# Altium schematic sheet 03_electrode_interface.SchDoc
size A3
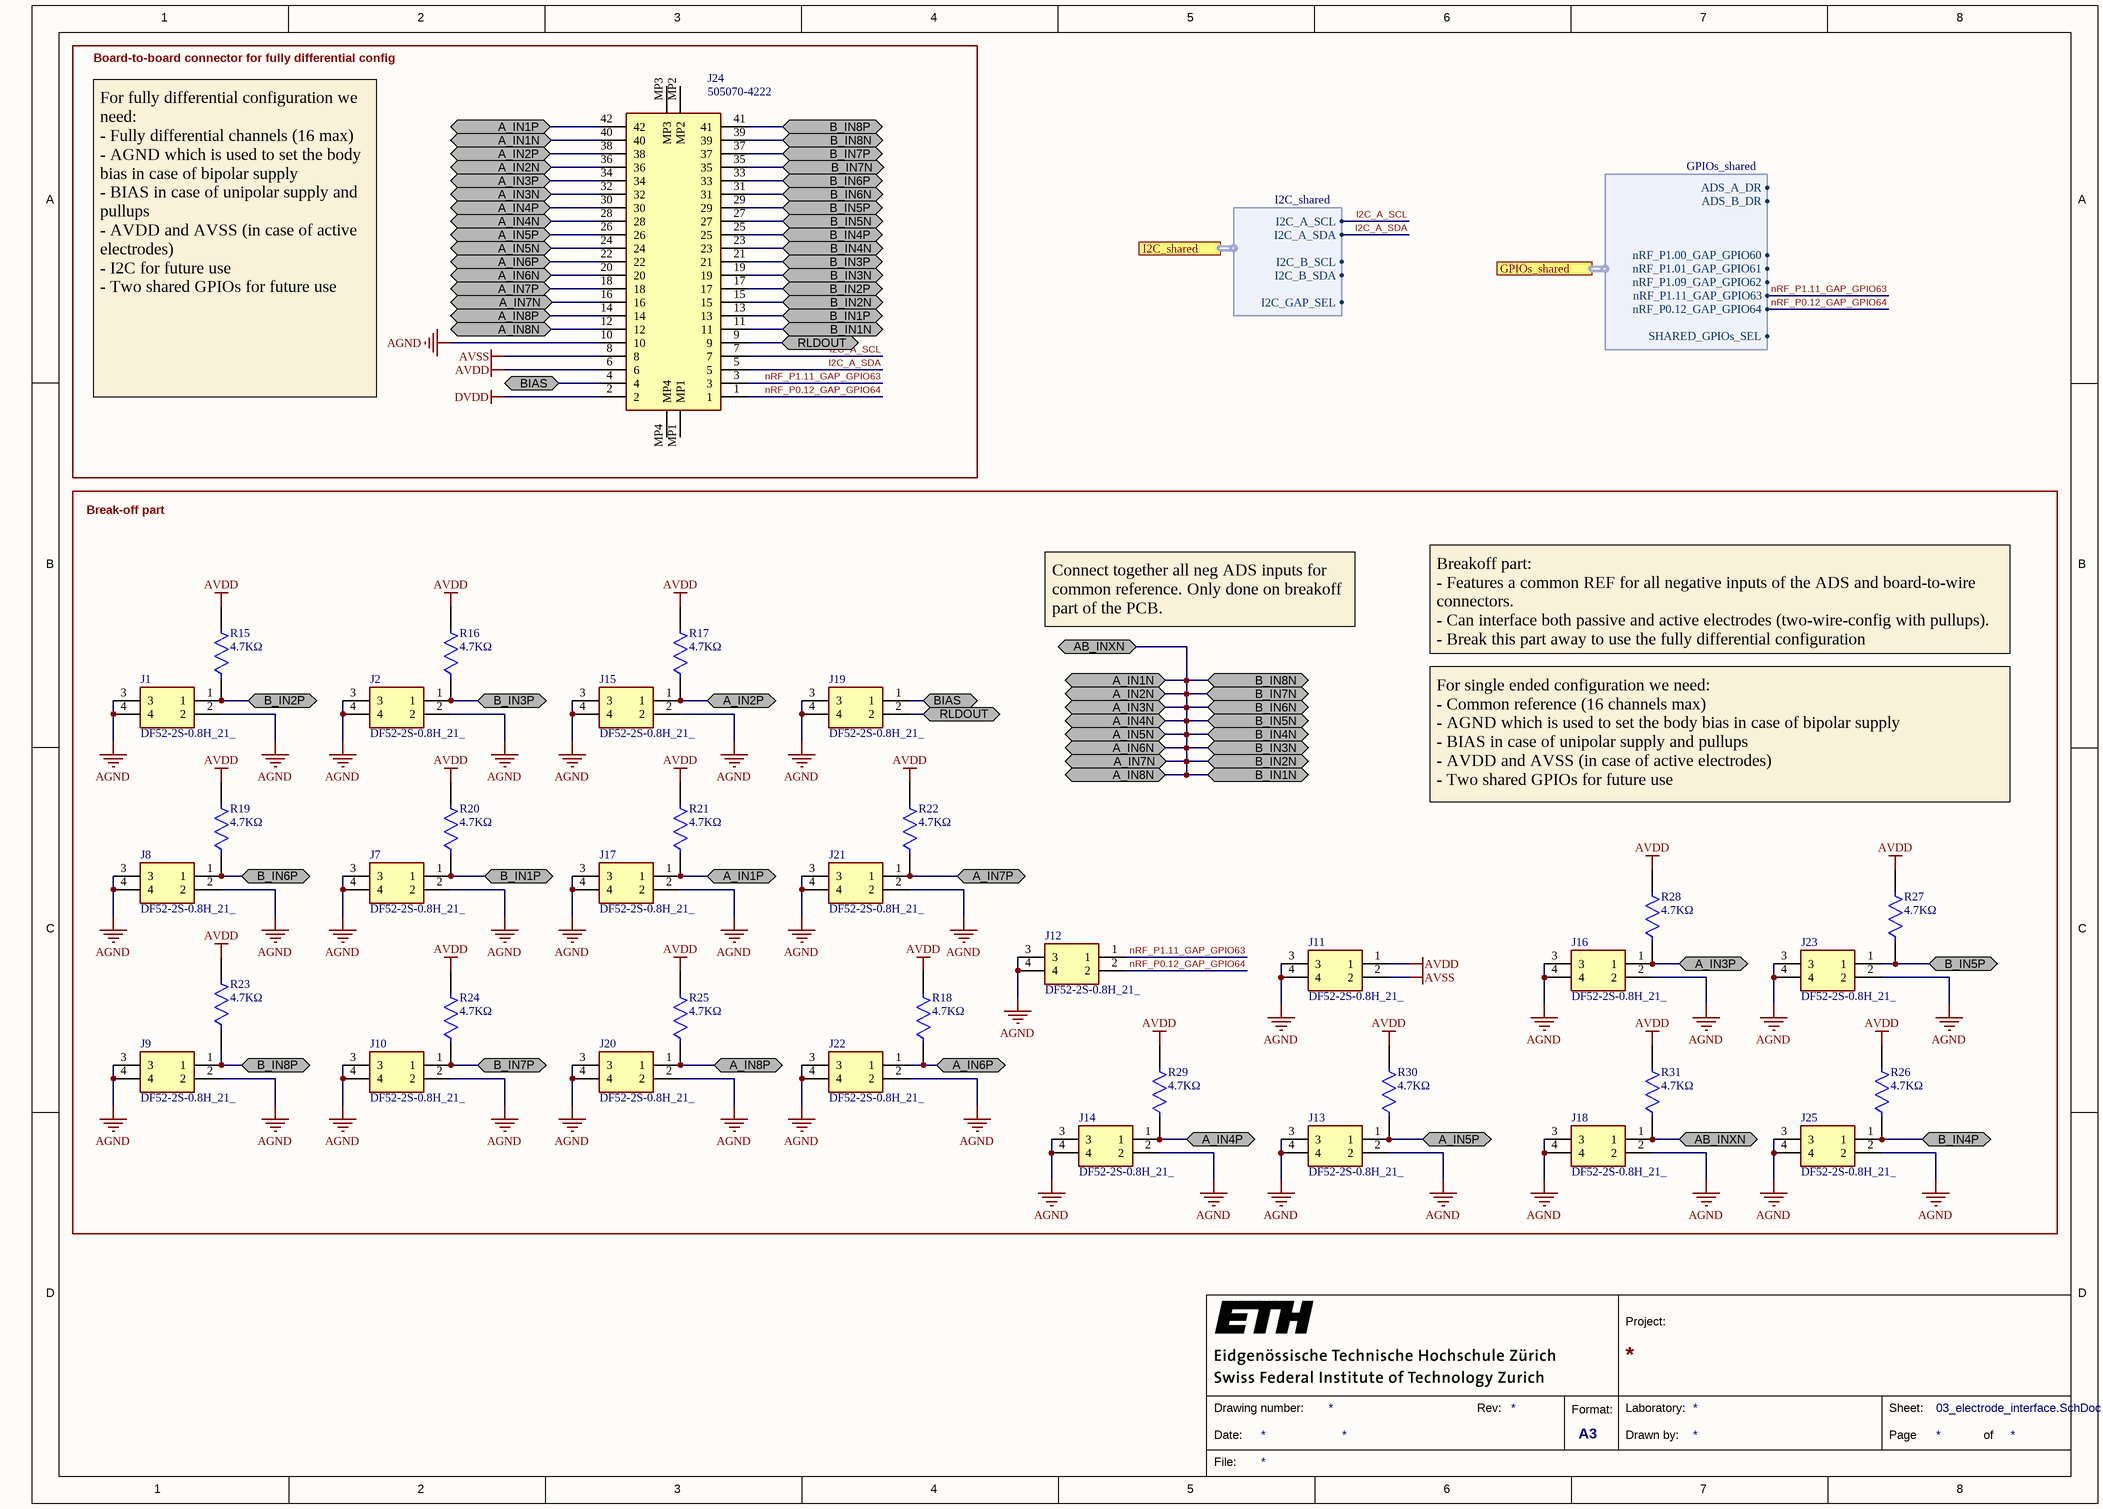
[diagram p0: 03_electrode_interface.SchDoc]

## Parts
J1  DF52-2S-0.8H_21_  [DF522S08H21]
J2  DF52-2S-0.8H_21_  [DF522S08H21]
J7  DF52-2S-0.8H_21_  [DF522S08H21]
J8  DF52-2S-0.8H_21_  [DF522S08H21]
J9  DF52-2S-0.8H_21_  [DF522S08H21]
J10  DF52-2S-0.8H_21_  [DF522S08H21]
J11  DF52-2S-0.8H_21_  [DF522S08H21]
J12  DF52-2S-0.8H_21_  [DF522S08H21]
J13  DF52-2S-0.8H_21_  [DF522S08H21]
J14  DF52-2S-0.8H_21_  [DF522S08H21]
J15  DF52-2S-0.8H_21_  [DF522S08H21]
J16  DF52-2S-0.8H_21_  [DF522S08H21]
J17  DF52-2S-0.8H_21_  [DF522S08H21]
J18  DF52-2S-0.8H_21_  [DF522S08H21]
J19  DF52-2S-0.8H_21_  [DF522S08H21]
J20  DF52-2S-0.8H_21_  [DF522S08H21]
J21  DF52-2S-0.8H_21_  [DF522S08H21]
J22  DF52-2S-0.8H_21_  [DF522S08H21]
J23  DF52-2S-0.8H_21_  [DF522S08H21]
J24  505070-4222  [5050704222]
J25  DF52-2S-0.8H_21_  [DF522S08H21]
R15  value 4.7KΩ  [FP-RT0402-MFG]  (hidden comment: RT0402FRE074K7L)
R16  value 4.7KΩ  [FP-RT0402-MFG]  (hidden comment: RT0402FRE074K7L)
R17  value 4.7KΩ  [FP-RT0402-MFG]  (hidden comment: RT0402FRE074K7L)
R18  value 4.7KΩ  [FP-RT0402-MFG]  (hidden comment: RT0402FRE074K7L)
R19  value 4.7KΩ  [FP-RT0402-MFG]  (hidden comment: RT0402FRE074K7L)
R20  value 4.7KΩ  [FP-RT0402-MFG]  (hidden comment: RT0402FRE074K7L)
R21  value 4.7KΩ  [FP-RT0402-MFG]  (hidden comment: RT0402FRE074K7L)
R22  value 4.7KΩ  [FP-RT0402-MFG]  (hidden comment: RT0402FRE074K7L)
R23  value 4.7KΩ  [FP-RT0402-MFG]  (hidden comment: RT0402FRE074K7L)
R24  value 4.7KΩ  [FP-RT0402-MFG]  (hidden comment: RT0402FRE074K7L)
R25  value 4.7KΩ  [FP-RT0402-MFG]  (hidden comment: RT0402FRE074K7L)
R26  value 4.7KΩ  [FP-RT0402-MFG]  (hidden comment: RT0402FRE074K7L)
R27  value 4.7KΩ  [FP-RT0402-MFG]  (hidden comment: RT0402FRE074K7L)
R28  value 4.7KΩ  [FP-RT0402-MFG]  (hidden comment: RT0402FRE074K7L)
R29  value 4.7KΩ  [FP-RT0402-MFG]  (hidden comment: RT0402FRE074K7L)
R30  value 4.7KΩ  [FP-RT0402-MFG]  (hidden comment: RT0402FRE074K7L)
R31  value 4.7KΩ  [FP-RT0402-MFG]  (hidden comment: RT0402FRE074K7L)

## Blocks framed on the sheet
Board-to-board connector for fully differential config: J24
Break-off part: J1 J2 J7-J23 J25 R15-R31

## Ports
A_IN1N (bidir), A_IN1P (bidir), A_IN2N (bidir), A_IN2P (bidir), A_IN3N (bidir), A_IN3P (bidir), A_IN4N (bidir), A_IN4P (bidir), A_IN5N (bidir), A_IN5P (bidir), A_IN6N (bidir), A_IN6P (bidir), A_IN7N (bidir), A_IN7P (bidir), A_IN8N (bidir), A_IN8P (bidir), AB_INXN (bidir), B_IN1N (bidir), B_IN1P (bidir), B_IN2N (bidir), B_IN2P (bidir), B_IN3N (bidir), B_IN3P (bidir), B_IN4N (bidir), B_IN4P (bidir), B_IN5N (bidir), B_IN5P (bidir), B_IN6N (bidir), B_IN6P (bidir), B_IN7N (bidir), B_IN7P (bidir), B_IN8N (bidir), B_IN8P (bidir), BIAS (bidir), GPIOs_shared (harness GPIOs_shared), I2C_shared (harness I2C_shared), RLDOUT (bidir)

## Harnesses
GPIOs_shared: ADS_A_DR, ADS_B_DR, nRF_P1.00_GAP_GPIO60, nRF_P1.09_GAP_GPIO62, nRF_P1.11_GAP_GPIO63, nRF_P0.12_GAP_GPIO64, SHARED_GPIOs_SEL, nRF_P1.01_GAP_GPIO61
I2C_shared: I2C_A_SCL, I2C_A_SDA, I2C_B_SCL, I2C_B_SDA, I2C_GAP_SEL

## Nets
AGND: J1.2 J1.3 J1.4 J2.2 J2.3 J2.4 J7.2 J7.3 J7.4 J8.2 J8.3 J8.4 J9.2 J9.3 J9.4 J10.2 J10.3 J10.4 J11.3 J11.4 J12.3 J12.4 J13.2 J13.3 J13.4 J14.2 J14.3 J14.4 J15.2 J15.3 J15.4 J16.2 J16.3 J16.4 J17.2 J17.3 J17.4 J18.2 J18.3 J18.4 J19.3 J19.4 J20.2 J20.3 J20.4 J21.2 J21.3 J21.4 J22.2 J22.3 J22.4 J23.2 J23.3 J23.4 J24.10 J25.2 J25.3 J25.4
AVDD: J11.1 J24.6 R15.2 R16.2 R17.2 R18.2 R19.2 R20.2 R21.2 R22.2 R23.2 R24.2 R25.2 R26.2 R27.2 R28.2 R29.2 R30.2 R31.2
AVSS: J11.2 J24.8
DVDD: J24.2
A_IN1N: J18.1 J24.11 J24.12 J24.15 J24.16 J24.19 J24.20 J24.23 J24.24 J24.27 J24.28 J24.31 J24.32 J24.35 J24.36 J24.39 J24.40 R31.1 ; port A_IN1N, port A_IN2N, port A_IN3N, port A_IN4N, port A_IN5N, port A_IN6N, port A_IN7N, port A_IN8N, port B_IN1N, port B_IN2N, port B_IN3N, port B_IN4N, port B_IN5N, port B_IN6N, port B_IN7N, port B_IN8N, port AB_INXN
A_IN1P: J17.1 J24.42 R21.1 ; port A_IN1P
A_IN2P: J15.1 J24.38 R17.1 ; port A_IN2P
A_IN3P: J16.1 J24.34 R28.1 ; port A_IN3P
A_IN4P: J14.1 J24.30 R29.1 ; port A_IN4P
A_IN5P: J13.1 J24.26 R30.1 ; port A_IN5P
A_IN6P: J22.1 J24.22 R18.1 ; port A_IN6P
A_IN7P: J21.1 J24.18 R22.1 ; port A_IN7P
A_IN8P: J20.1 J24.14 R25.1 ; port A_IN8P
B_IN1P: J7.1 J24.13 R20.1 ; port B_IN1P
B_IN2P: J1.1 J24.17 R15.1 ; port B_IN2P
B_IN3P: J2.1 J24.21 R16.1 ; port B_IN3P
B_IN4P: J24.25 J25.1 R26.1 ; port B_IN4P
B_IN5P: J23.1 J24.29 R27.1 ; port B_IN5P
B_IN6P: J8.1 J24.33 R19.1 ; port B_IN6P
B_IN7P: J10.1 J24.37 R24.1 ; port B_IN7P
B_IN8P: J9.1 J24.41 R23.1 ; port B_IN8P
BIAS: J19.1 J24.4 ; port BIAS
I2C_A_SCL: J24.7 ; port I2C_shared.I2C_A_SCL
I2C_A_SDA: J24.5 ; port I2C_shared.I2C_A_SDA
nRF_P0.12_GAP_GPIO64: J12.2 J24.1 ; port GPIOs_shared.nRF_P0.12_GAP_GPIO64
nRF_P1.11_GAP_GPIO63: J12.1 J24.3 ; port GPIOs_shared.nRF_P1.11_GAP_GPIO63
RLDOUT: J19.2 J24.9 ; port RLDOUT

Not connected (* = marked no-connect by the designer): J24 MP1 MP2 MP3 MP4

## Notes on the sheet
- For fully differential configuration we need:
  - Fully differential channels (16 max)
  - AGND which is used to set the body bias in case of bipolar supply
  - BIAS in case of unipolar supply and pullups
  - AVDD and AVSS (in case of active electrodes)
  - I2C for future use
  - Two shared GPIOs for future use
- Connect together all neg ADS inputs for common reference. Only done on breakoff part of the PCB.
- Breakoff part:
  - Features a common REF for all negative inputs of the ADS and board-to-wire connectors.
  - Can interface both passive and active electrodes (two-wire-config with pullups).
  - Break this part away to use the fully differential configuration
- For single ended configuration we need:
  - Common reference (16 channels max)
  - AGND which is used to set the body bias in case of bipolar supply
  - BIAS in case of unipolar supply and pullups
  - AVDD and AVSS (in case of active electrodes)
  - Two shared GPIOs for future use
- 1
- 2
- 3
- 4
- 5
- 6
- 7
- 8
- A
- B
- C
- D
- Project:
- Date:
- Drawing number:
- Rev:
- Format:
- A3
- Drawn by:
- Laboratory:
- Page
- Sheet:
- of
- File:

## Library data of the parts
J1 J2 J7-J23 J25 = DF52-2S-0.8H_21_: Connector; Manufacturer_Name: Hirose; Manufacturer_Part_Number: DF52-2S-0.8H(21); Datasheet Link: https://datasheet.datasheetarchive.com/originals/distributors/DKDS-30/591726.pdf; Height: 1mm; Mouser Part Number: 798-DF52-2S-0.8H21; Mouser Price/Stock: https://www.mouser.co.uk/ProductDetail/Hirose-Connector/DF52-2S-0.8H21?qs=%2FKR40Cd6GUpAHUMGMtWbig%3D%3D
J24 = 505070-4222: Connector; Manufacturer_Name: Molex; Manufacturer_Part_Number: 505070-4022; Datasheet Link: https://componentsearchengine.com/Datasheets/1/505070-4022.pdf; Height: 0.53mm; Mouser Part Number: 538-505070-4022; Mouser Price/Stock: https://www.mouser.co.uk/ProductDetail/Molex/505070-4022?qs=byeeYqUIh0Nt60HVGOVJPw%3D%3D
R15-R31 = CMP-2002-02901-2: RES 4.70K OHM 1/16W 1% SMD 0402; Manufacturer: Yageo; Voltage Rating: 50V; Temperature Coefficient: 50 ppm/°C; Tolerance: 0.01; Power Rating: 0.063W; ComponentLink2URL: http://www.yageo.com/documents/recent/PYu-RT_1-to-0.01_RoHS_L_9.pdf; Temperature Range High: +155°C; Mouser Description: Res Thin Film 0402 4.7K Ohm 1% 1/16W ±50ppm/°C SMD Paper T/R; Temperature Range Low: -55°C; Device Class L1: Passive Components; Lead Free: Yes; Series: RT; Resistance: 4.7KΩ; Automotive: No; Manufacturer Part Number: RT0402FRE074K7L; Package: RT0402; Composition: Thin Film; RoHS: TRUE; ComponentLink2Description: Datasheet; Octopart: https://octopart.com/rt0402fre074k7l-yageo-1371922; Footprint Url: http://www.yageo.com/exep/pages/download/literatures/PYu-R_Mount_10.pdf; Height: 0.35mm; Category: Res; Device Class L3: Chip SMD Resistors; Temperature: -55°C to +155°C; Digikey Description: RES 4.70K OHM 1/16W 1% SMD 0402; Device Class L2: Resistors; Ipc Land Pattern Name: RESC10050X30